# EAGLE design ps for AOM_AZ (EAGLE 6.6.0)
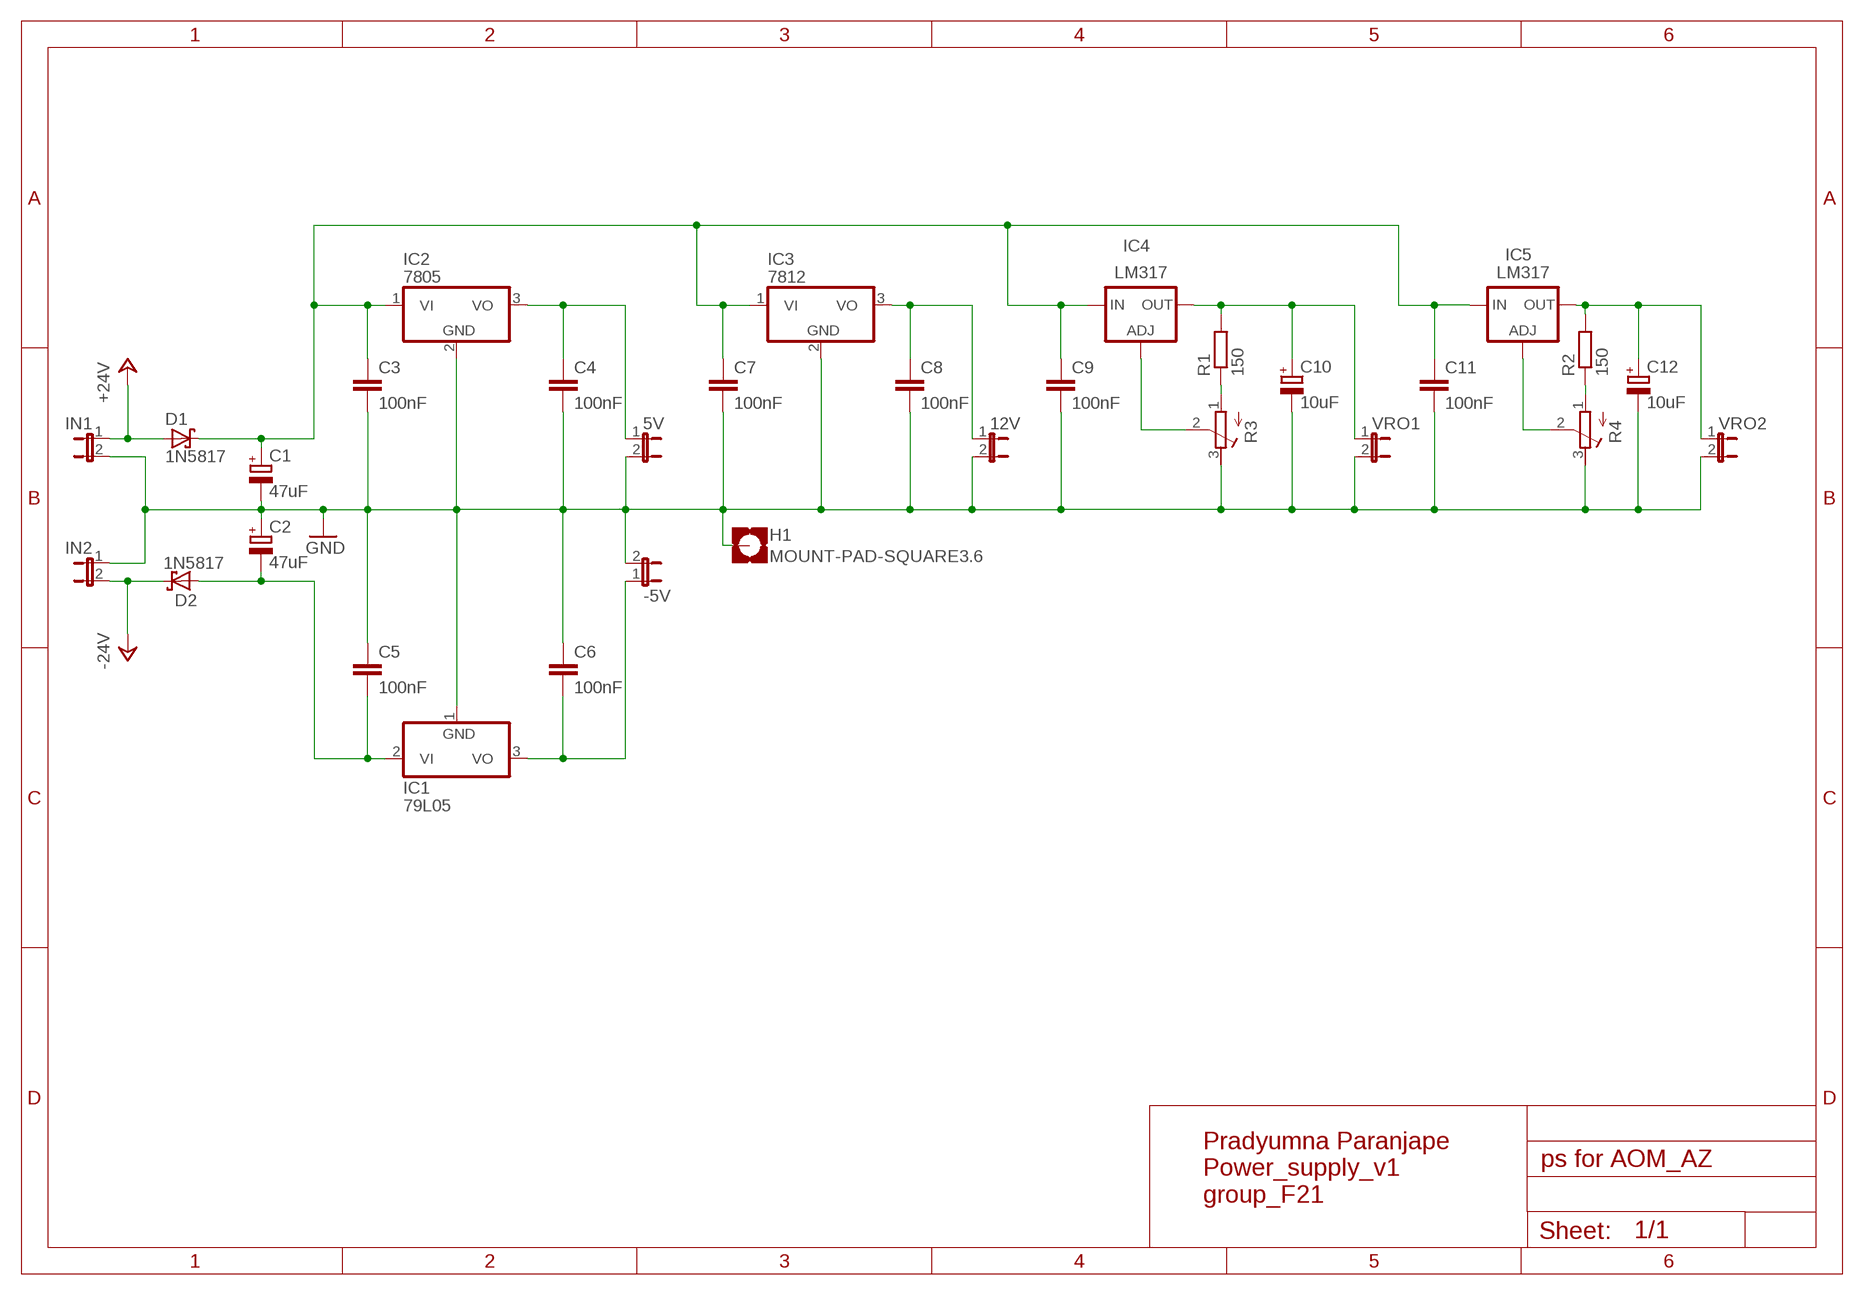
[diagram p0: schematic, sheet 1]

## Parts
5V  JP1E  [JP1]
12V  JP1E  [JP1]
-5V  JP1E  [JP1]
C1  47uF  CPOL-EUE5-6  [E5-6]
C2  47uF  CPOL-EUE5-6  [E5-6]
C3  100nF  C-EUC1206K  [C1206K]
C4  100nF  C-EUC1206K  [C1206K]
C5  100nF  C-EUC1206K  [C1206K]
C6  100nF  C-EUC1206K  [C1206K]
C7  100nF  C-EUC1206K  [C1206K]
C8  100nF  C-EUC1206K  [C1206K]
C9  100nF  C-EUC1206K  [C1206K]
C10  10uF  CPOL-EUE1.8-4  [E1,8-4]
C11  100nF  C-EUC1206K  [C1206K]
C12  10uF  CPOL-EUE1.8-4  [E1,8-4]
D1  1N5817  1N5817-B  [DO41-7.6]
D2  1N5817  1N5817-B  [DO41-7.6]
H1  MOUNT-PAD-SQUARE3.6  [3,6-PAD-SQUARE]
IC1  79L05  7905L  [TO92]
IC2  7805  7805T  [TO220H]
IC3  7812  7812T  [TO220H]
IC4  LM317  LM317TO220H  [TO220H]
IC5  LM317  LM317TO220H  [TO220H]
IN1  JP1E  [JP1]
IN2  JP1E  [JP1]
R1  150  R-EU_R1206  [R1206]
R2  150  R-EU_R1206  [R1206]
R3  R-TRIMM3296Y  [RTRIM3296Y]
R4  R-TRIMM3296Y  [RTRIM3296Y]
VRO1  JP1E  [JP1]
VRO2  JP1E  [JP1]

## Nets
+24V: D1.A IN1.1
+VS: C1.+ C3.1 C7.1 C9.1 C11.1 D1.C IC2.1(VI) IC3.1(VI) IC4.3(IN) IC5.3(IN)
-24V: D2.C IN2.2
-VS: C2.- C5.2 D2.A IC1.2(VI)
GND: 5V.2 12V.2 -5V.2 C1.- C2.+ C3.2 C4.2 C5.1 C6.1 C7.2 C8.2 C9.2 C10.- C11.2 C12.- H1.B3,6(MOUNT) IC1.1(GND) IC2.2(GND) IC3.2(GND) IN1.2 IN2.1 R3.3(E) R4.3(E) VRO1.2 VRO2.2
N$1: C12.+ IC5.2(OUT) R2.2 VRO2.1
N$3: 12V.1 C8.1 IC3.3(VO)
N$4: 5V.1 C4.1 IC2.3(VO)
N$5: -5V.1 C6.2 IC1.3(VO)
N$6: R1.1 R3.1(A)
N$7: IC4.1(ADJ) R3.2(S)
N$8: C10.+ IC4.2(OUT) R1.2 VRO1.1
N$11: R2.1 R4.1(A)
N$12: IC5.1(ADJ) R4.2(S)

## Notes on the sheet
- Pradyumna Paranjape
  Power_supply_v1
  group_F21

## Library data of the parts
5V 12V -5V IN1 IN2 VRO1 VRO2 = jumper:JP1E: JUMPER
C1 C2 C10 C12 = rcl:CPOL-EU: POLARIZED CAPACITOR, European symbol
C3-C9 C11 = rcl:C-EU: CAPACITOR, European symbol
D1 D2 = diode:1N581*: 1.0A SCHOTTKY BARRIER RECTIFIER Source: http://www.diodes.com/datasheets/ds23001.pdf
H1 = holes:MOUNT-PAD-SQUARE: MOUNTING PAD, square
IC1 = linear:79*: Negative VOLTAGE REGULATOR
IC2 IC3 = linear:78*: Positive VOLTAGE REGULATOR Source: http://cache.national.com/ds/LM/LM78L05.pdf http://www.fairchildsemi.com/ds/LM/LM7805.pdf
IC4 IC5 = v-reg:LM317?*: 500 mA Adjustable Output Positive Voltage Regulator Source: http://www.onsemi.co.jp .. LM317M-D.PDF
R1 R2 = rcl:R-EU_: RESISTOR, European symbol
R3 R4 = rcl:R-TRIMM: Trimm resistor

## Net classes
0 default: width 0.381 mm, drill 0.254 mm, clearance 0.254 mm

## Board
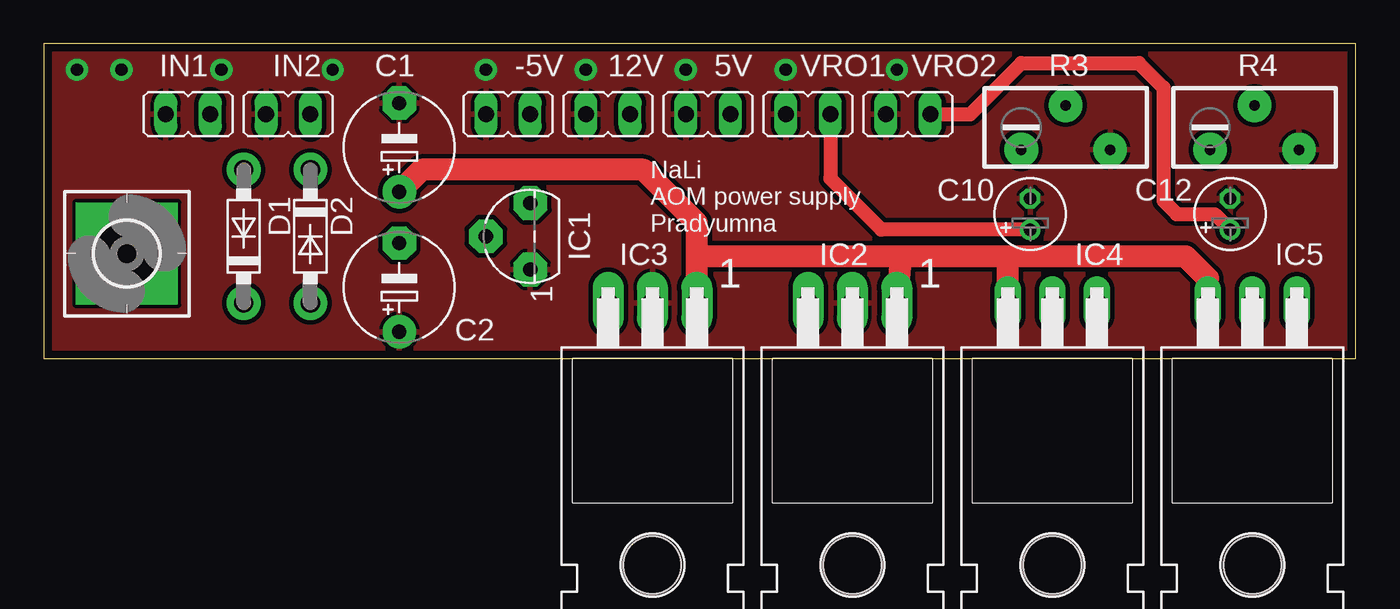
[diagram p1: board, top side]
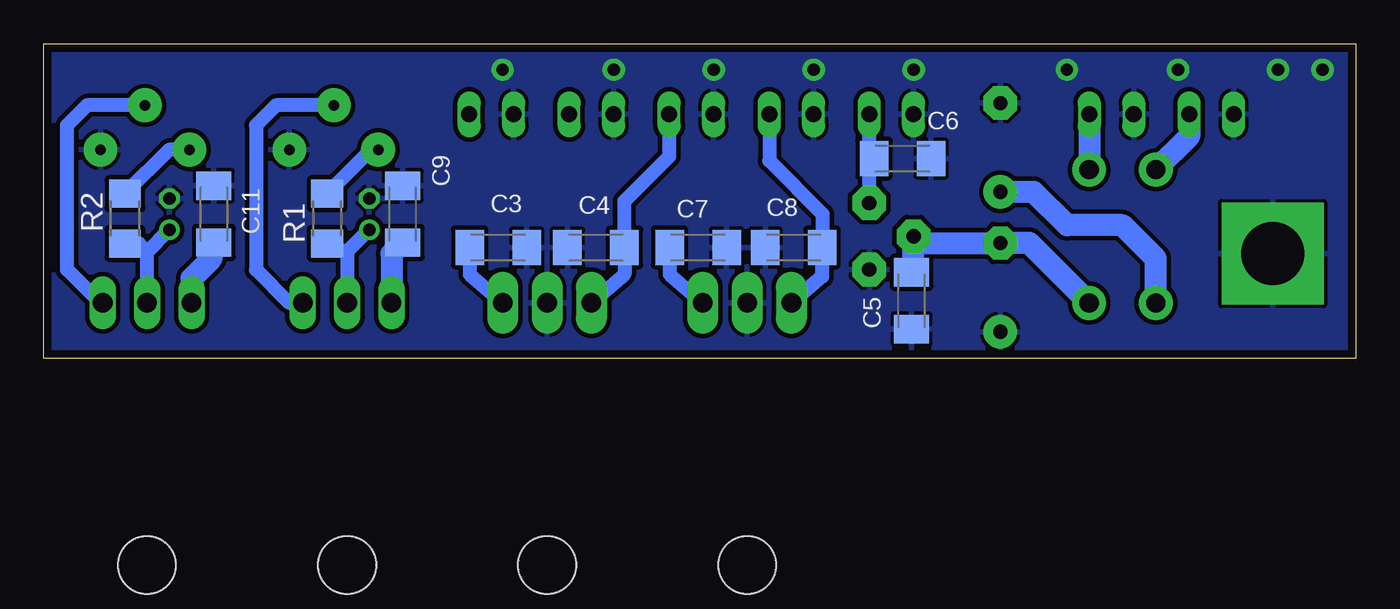
[diagram p2: board, bottom side, seen from below]

Size 75 x 18 mm. Coordinates in mm from the lower left corner, seen from the top.
Outline: 0,0 75,0 75,18 0,18 0,0
Copper layers (1*16): Top 0.018mm / dielectric 1.55mm / Bottom 0.018mm
Design rules "eC-STANDARD_pool-2-layer ": minimum track width 0.15mm, minimum drill 0.25mm, track to track 0.15mm, track to pad 0.15mm, pad to pad 0.15mm, via to via 0.15mm, smd to smd 0.15mm, copper to edge 0.45mm, drill to drill 0.3mm, minimum pad ring 0.2mm, minimum via ring 0.2mm, stop-mask expansion 0.1mm, vias tented up to drill 0mil, thermal gap 0.2mm

### Footprints (pad centres in the part's own frame; a part is rotated, then mirrored left to right if it is on the bottom)
JP1 = drill 0.914 long: 1 0,-1.27; 2 0,1.27
E5-6 = drill 0.813 pad 1.905: + -2.54,0 | drill 0.813 pad 1.905 octagon: - 2.54,0
C1206K = smd 1.626 x 2: 1 -1.626,0; 2 1.626,0
E1,8-4 = drill 0.711 pad 1.168: + -0.889,0 | drill 0.711 pad 1.168 octagon: - 0.889,0
DO41-7.6 = drill 1.1 pad 1.93: A 3.81,0; C -3.81,0
3,6-PAD-SQUARE = drill 3.6 pad 5.842 square: B3,6 0,0
TO92 = drill 0.813 pad 1.93 octagon: 1 -1.905,0; 2 0,2.54; 3 1.905,0
TO220H = drill 1.118 pad 1.778 long: 1 -2.54,-10.16; 2 0,-10.16; 3 2.54,-10.16 | hole 3.302: 0,4.826
TO220H' = drill 1.118 long: 1 -2.54,-10.16; 2 0,-10.16; 3 2.54,-10.16 | hole 3.302: 0,4.826
R1206 = smd 1.6 x 1.803: 1 -1.422,0; 2 1.422,0
RTRIM3296Y = drill 0.61 pad 1.93: 1 1.27,-2.54; 2 -1.27,0; 3 1.27,2.54

### Placement (x,y rotation side)
5V  37.97,13.97 90 top
12V  32.26,13.97 90 top
-5V  26.54,13.97 90 top
C1  20.32,12.06 90 top
C2  20.32,4.06 90 top
C3  49.02,6.35 0 bottom
C4  43.43,6.35 180 bottom
C5  25.4,3.3 90 bottom
C6  25.91,11.43 180 bottom
C7  37.59,6.35 0 bottom
C8  32.13,6.35 180 bottom
C9  54.48,8.26 90 bottom
C10  56.39,8.26 90 top
C11  65.28,8.26 90 bottom
C12  67.82,8.26 90 top
D1  11.43,6.99 90 top
D2  15.24,6.99 270 top
H1  4.75,5.99 0 top
IC1  27.81,6.99 90 top
IC2  46.23,-6.99 180 top
IC3  34.8,-6.99 180 top
IC4  LM317  [TO220H']  57.66,-6.99 180 top
IC5  LM317  [TO220H']  69.09,-6.99 180 top
IN1  8.26,13.97 90 top
IN2  13.97,13.97 270 top
R1  58.8,8 270 bottom
R2  70.36,8 270 bottom
R3  58.42,13.21 270 top
R4  69.22,13.21 270 top
VRO1  43.69,13.97 90 top
VRO2  49.4,13.97 90 top

### Tracks (layer width: path | path; a pad name or v marks a point on that pad's centre or on a via)
+24V
  Bottom 1.27: IN1.1 9.53,12.7 D1.A
+VS
  Top 1.27: IC5.3 66.55,4.57 65.28,5.84 55.12,5.84 | 55.12,5.84 49.02,5.84 | 49.02,5.84 37.34,5.84 | IC4.3 55.12,5.84 | IC2.1 49.02,5.84 | IC3.1 37.34,5.84 | 37.34,5.84 37.34,7.75 34.29,10.79 21.59,10.79 C1.+
  Bottom 0.813: C3.1 50.65,4.8 IC2.1 | C7.1 39.22,4.8 IC3.1
  Bottom 1.27: C11.1 65.41,6.5 65.41,5.71 66.55,4.57 IC5.3 | C9.1 55.12,5.99 IC4.3 | D1.C 11.43,5.71 13.34,7.62 16.51,7.62 18.41,9.53 C1.+
-24V
  Bottom 1.27: IN2.2 D2.C
-VS
  Bottom 1.27: D2.A 18.67,6.6 C2.- 24.89,6.6 IC1.2 25.27,5.05 C5.2
GND  (via drill 0.7 pad 1.27)
  other vias: 16.51,16.51 25.27,16.51 30.99,16.51 36.7,16.51 42.42,16.51 48.77,16.51 10.16,16.51 1.91,16.51 4.45,16.51
  pour Bottom (isolate 0.254): -0.64,-0.64 75.56,-0.64 75.56,18.41 -0.64,18.41
  pour Top (isolate 0.254): -0.64,-1.27 76.2,-1.27 76.2,18.41 -0.64,18.41
N$1
  Top 0.813: VRO2.1 52.96,13.97 55.88,16.89 62.61,16.89 64.01,15.49 64.01,9.02 64.77,8.26 66.93,8.26 C12.+
  Bottom 0.813: IC5.2 69.09,6.1 | 69.09,6.1 C12.+ | R2.2 69.57,6.58 69.09,6.1
N$3
  Bottom 0.813: IC3.3 30.5,4.67 C8.1 30.48,6.38 30.48,8.26 33.53,11.3 12V.1
N$4
  Bottom 0.813: IC2.3 41.81,4.8 C4.1 41.81,8.99 39.24,11.56 5V.1
N$5
  Bottom 0.813: IC1.3 27.81,11.43 | 27.81,11.43 -5V.1 | C6.2 27.81,11.43
N$6
  Bottom 0.813: R3.1 56.28,11.94 R1.1
N$7
  Bottom 0.813: R3.2 61.72,14.48 62.87,13.34 62.87,5.08 60.96,3.17 IC4.1
N$8
  Top 0.813: C10.+ 47.88,7.37 44.96,10.29 VRO1.1
  Bottom 0.813: C10.+ 57.59,6.16 | 57.59,6.16 57.66,6.1 IC4.2 | R1.2 58.38,6.16 57.59,6.16
N$11
  Bottom 0.813: R4.1 67.84,11.94 R2.1
N$12
  Bottom 0.813: IC5.1 71.75,3.17 73.66,5.08 73.66,13.34 72.52,14.48 R4.2

### Text on the board
tNames: NaLi / AOM power supply / Pradyumna